# Altium schematic sheet Amp Bias.SchDoc
size 406 x 304 mm; SheetNumber: 2; SheetTotal: 6
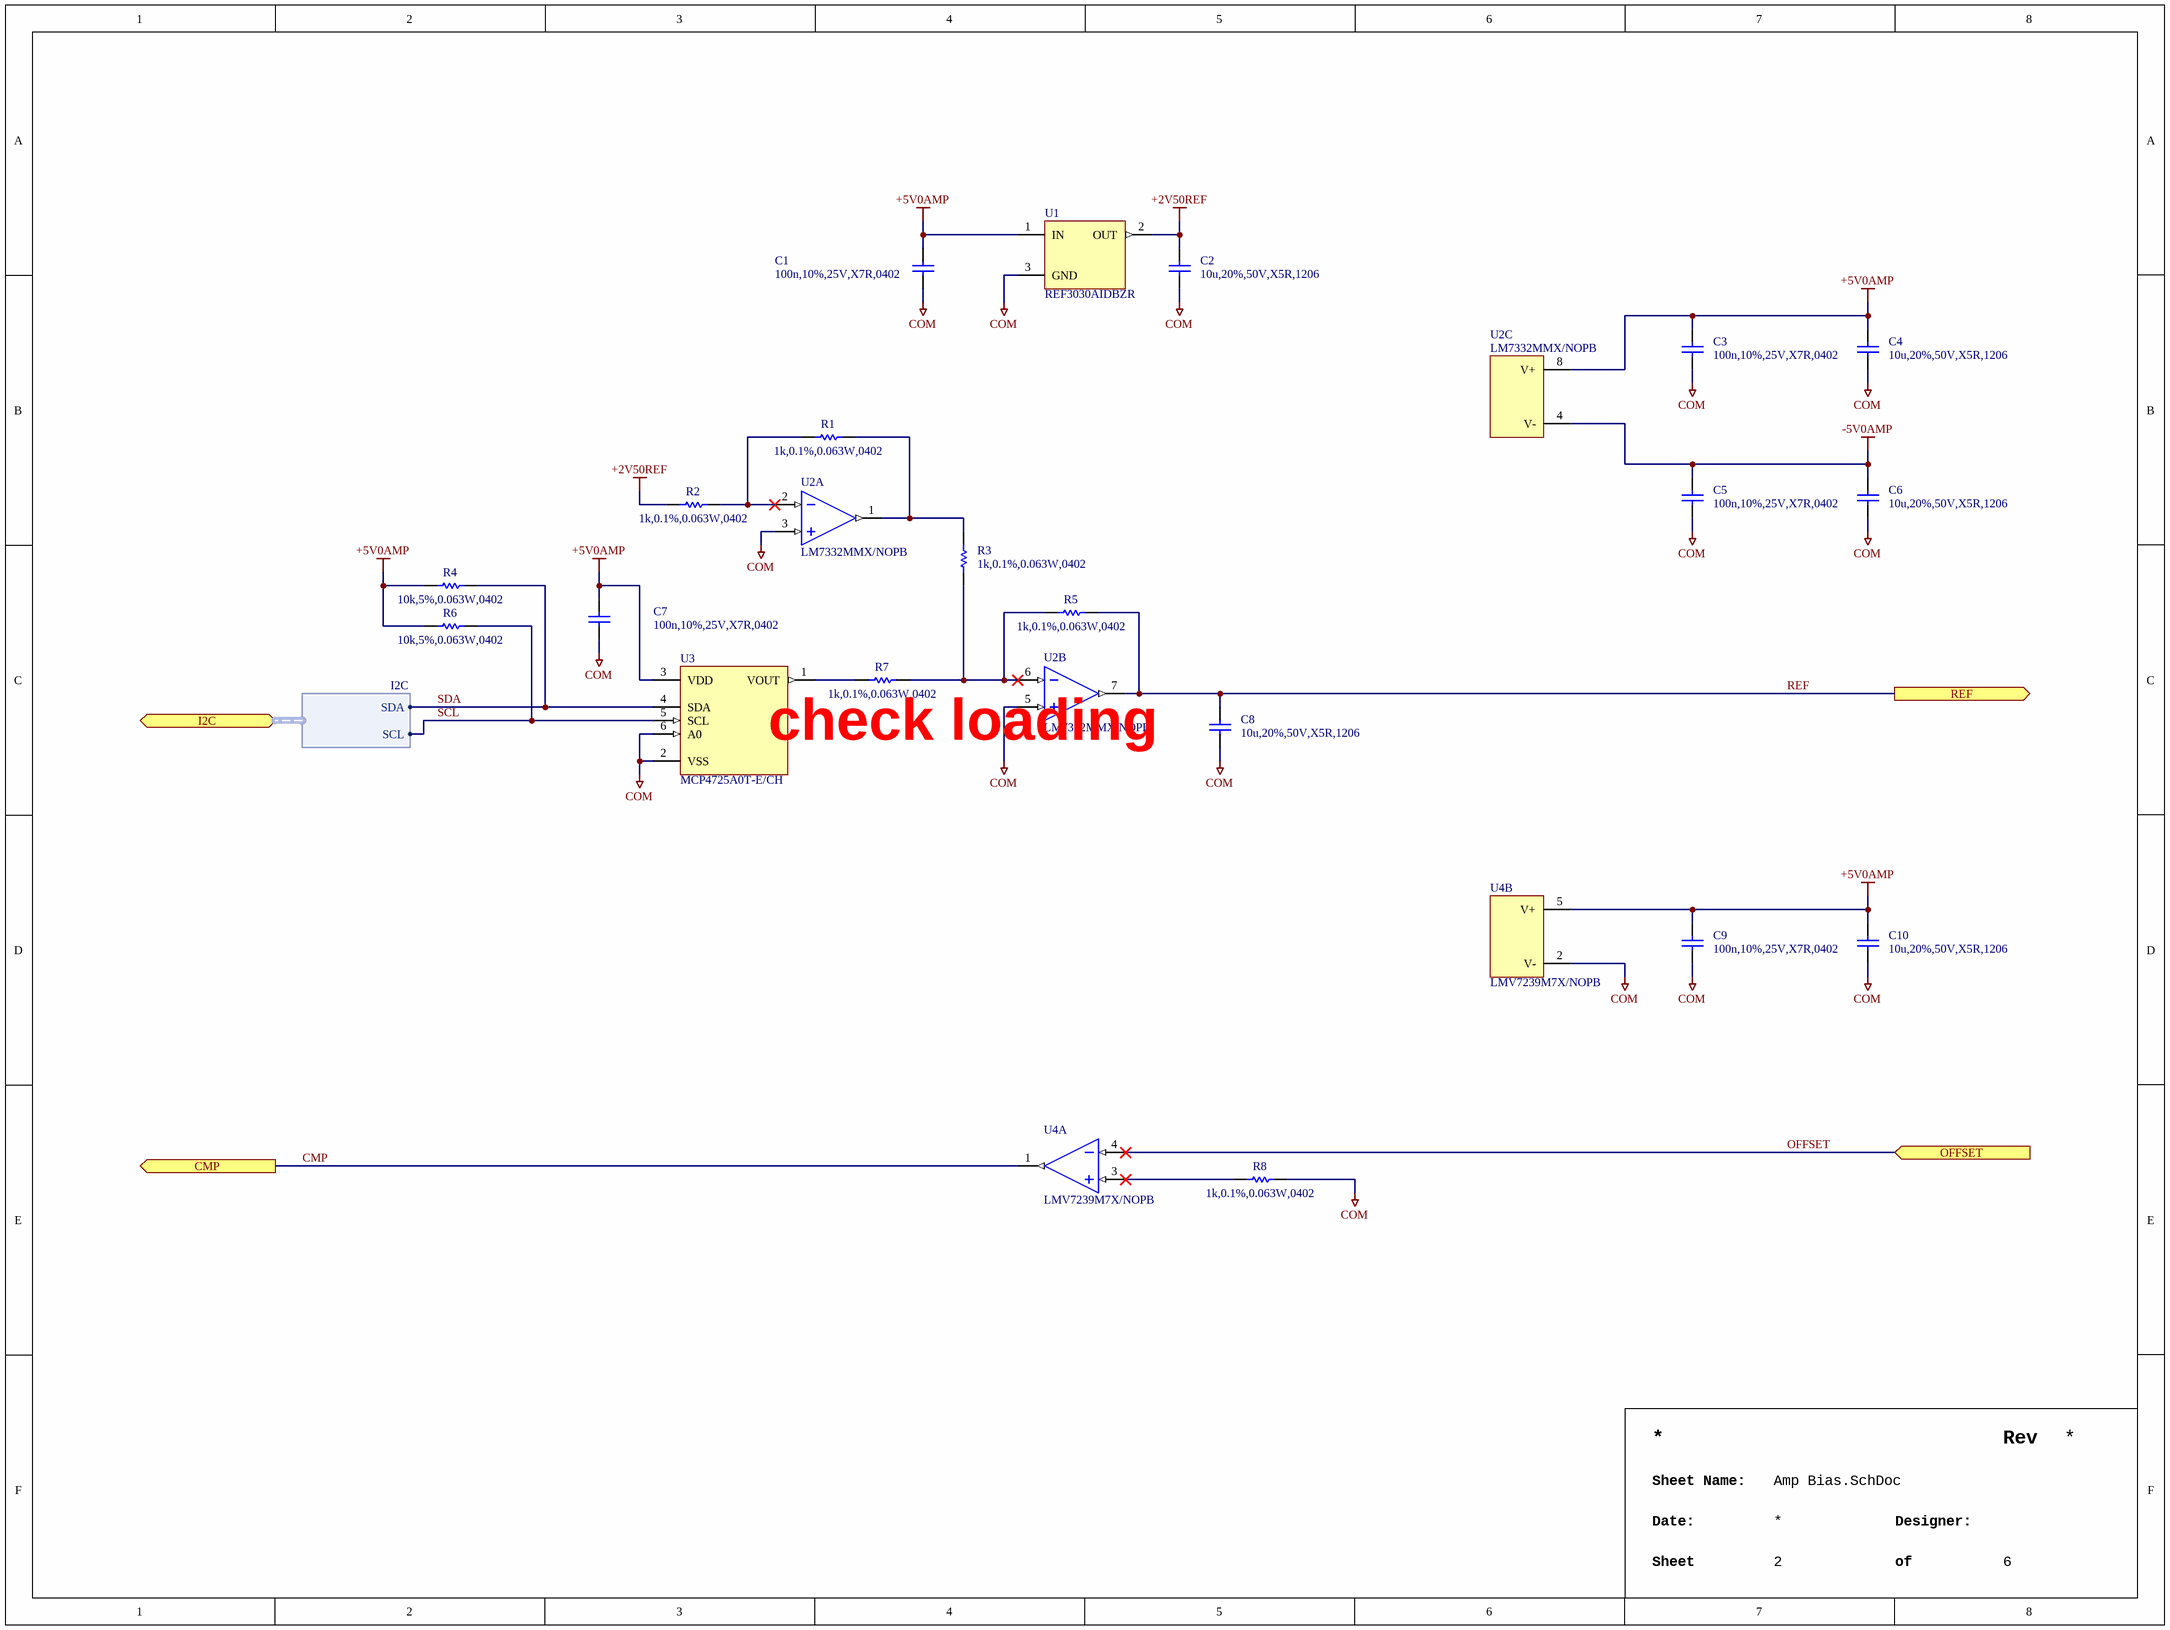
[diagram p0: Amp Bias.SchDoc]

## Parts
C1  100n,10%,25V,X7R,0402  [CAPC1005X06N]
C2  10u,20%,50V,X5R,1206  [CAPC3216X16N]
C3  100n,10%,25V,X7R,0402  [CAPC1005X06N]
C4  10u,20%,50V,X5R,1206  [CAPC3216X16N]
C5  100n,10%,25V,X7R,0402  [CAPC1005X06N]
C6  10u,20%,50V,X5R,1206  [CAPC3216X16N]
C7  100n,10%,25V,X7R,0402  [CAPC1005X06N]
C8  10u,20%,50V,X5R,1206  [CAPC3216X16N]
C9  100n,10%,25V,X7R,0402  [CAPC1005X06N]
C10  10u,20%,50V,X5R,1206  [CAPC3216X16N]
R1  1k,0.1%,0.063W,0402  [RESC1005X04N]
R2  1k,0.1%,0.063W,0402  [RESC1005X04N]
R3  1k,0.1%,0.063W,0402  [RESC1005X04N]
R4  10k,5%,0.063W,0402  [RESC1005X04N]
R5  1k,0.1%,0.063W,0402  [RESC1005X04N]
R6  10k,5%,0.063W,0402  [RESC1005X04N]
R7  1k,0.1%,0.063W,0402  [RESC1005X04N]
R8  1k,0.1%,0.063W,0402  [RESC1005X04N]
U1  REF3030AIDBZR  [SOT95P237X112-3N]
U2  LM7332MMX/NOPB  [TEXASINSTRUMENTS_PKG_DGK0008A]  (parts A,B,C of 3)
U3  MCP4725A0T-E/CH  [SOTFL95P260X145-6]
U4  LMV7239M7X/NOPB  [SOTFL65P210X110-6N]  (parts A,B of 2)

## Ports
CMP (out), I2C (bidir, harness I2C), OFFSET (in), REF (out)

## Harnesses
I2C: SDA, SCL

## Nets
+2V50REF: C2.2 R2.1 U1.2(OUT)
+5V0AMP: C1.2 C3.2 C4.2 C7.2 C9.2 C10.2 R4.2 R6.2 U1.1(IN) U2.8(V+) U3.3(VDD) U4.5(V+)
-5V0AMP: C5.2 C6.2 U2.4(V-)
COM: C1.1 C2.1 C3.1 C4.1 C5.1 C6.1 C7.1 C8.1 C9.1 C10.1 R8.2 U1.3(GND) U2.3(INA+) U2.5(INB+) U3.2(VSS) U3.6(A0) U4.2(V-)
CMP: U4.1(VOUT) ; port CMP
OFFSET: U4.4(IN-) ; port OFFSET
REF: C8.2 R5.2 U2.7(OUTB) ; port REF
SCL: R6.1 U3.5(SCL) ; port I2C.SCL
SDA: R4.1 U3.4(SDA) ; port I2C.SDA
NetR1_1: R1.1 R2.2 U2.2(INA-)
NetR1_2: R1.2 R3.1 U2.1(OUTA)
NetR3_2: R3.2 R5.1 R7.2 U2.6(INB-)
NetR7_1: R7.1 U3.1(VOUT)
NetR8_1: R8.1 U4.3(IN+)

## Notes on the sheet
- check loading
- Rev
- Sheet Name:
- Date:
- Sheet
- Designer:
- of

## Library data of the parts
C1 C3 C5 C7 C9 = CAP,Cer,100nF,10%,25V,X7R,0402: 0.1ï¿½F ï¿½10% 25V Ceramic Capacitor X7R 0402 (1005 Metric); Manufacturer 1: Murata Electronics; Manufacturer 1 Part Number: GRM155R71E104KE14J; Vendor 1 Part Number: 490-14603-1-ND; Vendor 1: DigiKey; Value: 100nF; Part Name: CAP,Cer,100nF,10%,25V,X7R,0402; CreatedBy: Judd Foster; HelpURL: https://search.murata.co.jp/Ceramy/image/img/A01X/G101/ENG/GRM155R71E104KE14-01.pdf
C2 C4 C6 C8 C10 = CAP,Cer,10uF,50VDC,X5R,1206: 10ï¿½F ï¿½20% 50V Ceramic Capacitor X5R 1206 (3216 Metric); Manufacturer 1: Samsung Electro-Mechanics; Manufacturer 1 Part Number: CL31A106MBHNNNE; Vendor 1 Part Number: 1276-6736-1-ND; Vendor 1: Digikey; Part Name: CAP,Cer,10uF,50VDC,X5R,1206; CreatedBy: Judd Foster; HelpURL: https://www.samsungsem.com/resources/file/global/support/product_catalog/MLCC.pdf; Value: 10u
R1-R3 R5 R7 R8 = RES,1k,0.1%,0.063W,0402: 1 kOhms Â±0.1% 0.063W, 1/16W Chip Resistor 0402 (1005 Metric) Thin Film; Manufacturer 1: YAGEO; Manufacturer 1 Part Number: RT0402BRE071KL; Vendor 1 Part Number: YAG2306CT-ND; Vendor 1: DigiKey; Part Name: RES,1k,0.1%,0.063W,0402; CreatedBy: Judd Foster; HelpURL: https://www.yageo.com/upload/media/product/app/datasheet/rchip/pyu-rt_1-to-0.01_rohs_l.pdf; Value: 1k
R4 R6 = RES,10k,5%,0.063W,0402: 10 kOhms ï¿½5% 0.063W, 1/16W Chip Resistor 0402 (1005 Metric) Automotive AEC-Q200 Thick Film; Manufacturer 1: Stackpole Electronics Inc; Manufacturer 1 Part Number: RMCF0402JT10K0; Vendor 1 Part Number: RMCF0402JT10K0CT-ND; Vendor 1: DIgikey; Part Name: RES,10k,5%,0.063W,0402; CreatedBy: Judd Foster; HelpURL: https://www.seielect.com/catalog/sei-rmcf_rmcp.pdf; Value: 10k
U1 = REF3030AIDBZR: 3V ï¿½0.2% 3.05V~5.5V 25mA Fixed SOT-23 Voltage References ROHS; Manufacturer 1: Texas Instruments; Vendor 1 Part Number: C38423; Vendor 1: LCSC; Part Name: REF3030AIDBZR; CreatedBy: Judd Foster; HelpURL: https://www.ti.com/lit/ds/symlink/ref3030.pdf?ts=1702271215532&ref_url=https%253A%252F%252Fwww.ti.com%252Fproduct%252FREF3030%252Fpart-details%252FREF3030AIDBZR; Manufacturer 1 Part Number: REF3030AIDBZR
U2 = LM7332MMX_NOPB: General Purpose Amplifier 2 Circuit Rail-to-Rail 8-VSSOP; Manufacturer 1: Texas Instruments; Vendor 1 Part Number: 296-LM7332MMX/NOPBCT-ND; Vendor 1: DigiKey; Part Name: LM7332MMX_NOPB; CreatedBy: Judd Foster; HelpURL: https://www.ti.com/lit/ds/symlink/lm7332.pdf?HQS=dis-dk-null-digikeymode-dsf-pf-null-wwe&ts=1730932081789&ref_url=https%253A%252F%252Fwww.ti.com%252Fgeneral%252Fdocs%252Fsuppproductinfo.tsp%253FdistId%253D10%2526gotoUrl%253Dhttps%253A%252F%252Fwww.ti.com%; Manufacturer 1 Part Number: LM7332MMX/NOPB
U3 = MCP4725A0T-E/CH: 6us 12 I2C 2.7V~5.5V SOT-23-6 Digital To Analog Converters (DACs) ROHS; Manufacturer 1: Microchip; Vendor 1 Part Number: C144198; Vendor 1: LCSC; Part Name: MCP4725A0T-E/CH; CreatedBy: Judd Foster; HelpURL: https://datasheet.lcsc.com/lcsc/1811151442_Microchip-Tech-MCP4725A0T-E-CH_C144198.pdf; Manufacturer 1 Part Number: MCP4725A0T-E/CH
U4 = LMV7239M7X/NOPB: Comparator General Purpose Push-Pull SC-70-5; Manufacturer 1: Texas Instruments; Vendor 1 Part Number: 296-35198-1-ND; Vendor 1: Digikey; Part Name: LMV7239M7X/NOPB; CreatedBy: Judd Foster; HelpURL: https://www.ti.com/general/docs/suppproductinfo.tsp?distId=10&gotoUrl=https%3A%2F%2Fwww.ti.com%2Flit%2Fgpn%2Flmv7235; Manufacturer 1 Part Number: LMV7239M7X/NOPB